# EAGLE design PCB-base (EAGLE 6.6.0)
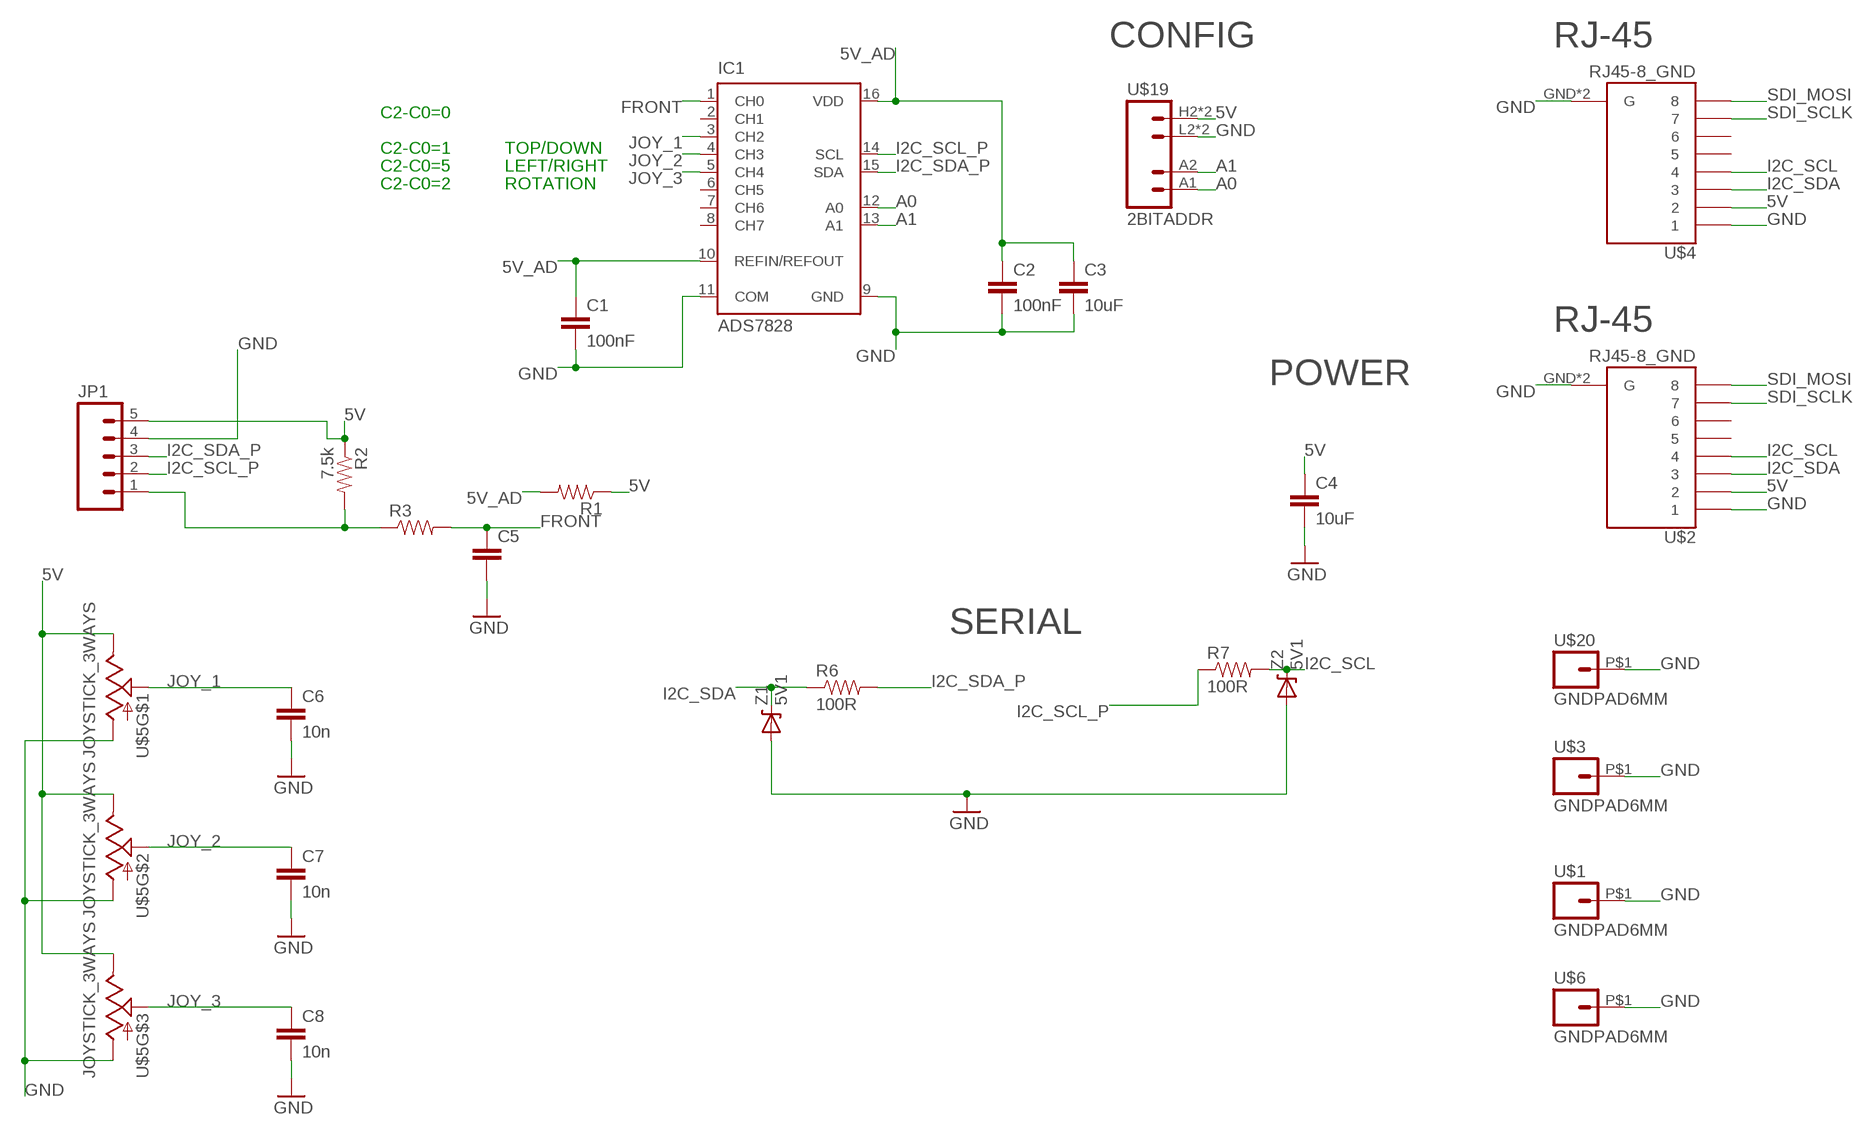
[diagram p0: schematic, sheet 1]

## Parts
C1  100nF  CAP0603-CAP  [0603-CAP]
C2  100nF  CAP0603-CAP  [0603-CAP]
C3  10uF  CAP0805  [0805]
C4  10uF  CAP0805  [0805]
C5  CAP0603-CAP  [0603-CAP]
C6  10n  CAP0603-CAP  [0603-CAP]
C7  10n  CAP0603-CAP  [0603-CAP]
C8  10n  CAP0603-CAP  [0603-CAP]
IC1  ADS7828  [TSSOP16-PW]
JP1  M05PTH  [1X05]
R1  RESISTOR0603-RES  [0603-RES]
R2  7.5k  RESISTOR0603-RES  [0603-RES]
R3  RESISTOR0603-RES  [0603-RES]
R6  100R  RESISTOR0603-RES  [0603-RES]
R7  100R  RESISTOR0603-RES  [0603-RES]
U$1  GNDPAD6MM  [3.2MMPAD6MM]
U$2  RJ45-8_GND  [RJ45-8_GND]
U$3  GNDPAD6MM  [3.2MMPAD6MM]
U$4  RJ45-8_GND  [RJ45-8_GND]
U$5  JOYSTICK_3WAYS  [JOYSTICK]
U$6  GNDPAD6MM  [3.2MMPAD6MM]
U$19  2BITADDR  [2BITADDR]
U$20  GNDPAD6MM  [3.2MMPAD6MM]
Z1  5V1  DIODE-ZENERSMB  [SMB-DIODE]
Z2  5V1  DIODE-ZENERSMB  [SMB-DIODE]

## Nets
5V [Power]: C4.1 JP1.5 R1.1 R2.1 U$2.2 U$4.2 U$5.LR_V(E) U$5.ROT_V(E) U$5.UD_V(E) U$19.H2(VCC) U$19.H3(VCC)
5V_AD [Power]: C1.1 C2.1 C3.1 IC1.10(REFIN/REFOUT) IC1.16(VDD) R1.2
A0: IC1.12(A0) U$19.A1
A1: IC1.13(A1) U$19.A2
FRONT: C5.1 IC1.1(CH0) R3.2
GND [Power]: C1.2 C2.2 C3.2 C4.2 C5.2 C6.2 C7.2 C8.2 IC1.9(GND) IC1.11(COM) JP1.4 U$1.P$1 U$2.1 U$2.GND1(G) U$2.GND(G) U$3.P$1 U$4.1 U$4.GND1(G) U$4.GND(G) U$5.LR_COM(A) U$5.ROT_COM(A) U$5.UD_COM(A) U$6.P$1 U$19.L2(GND) U$19.L3(GND) U$20.P$1 Z1.A Z2.A
I2C_SCL: R7.2 U$2.4 U$4.4 Z2.C
I2C_SCL_P: IC1.14(SCL) JP1.2 R7.1
I2C_SDA: R6.1 U$2.3 U$4.3 Z1.C
I2C_SDA_P: IC1.15(SDA) JP1.3 R6.2
JOY_1: C6.1 IC1.3(CH2) U$5.LR_C(S)
JOY_2: C7.1 IC1.4(CH3) U$5.UD_C(S)
JOY_3: C8.1 IC1.5(CH4) U$5.ROT_C(S)
N$234: JP1.1 R2.2 R3.1
SDI_MOSI: U$2.8 U$4.8
SDI_SCLK: U$2.7 U$4.7
Unconnected: IC1.2(CH1) IC1.6(CH5) IC1.7(CH6) IC1.8(CH7) U$2.5 U$2.6 U$4.5 U$4.6

## Notes on the sheet
- CONFIG | RJ-45
- C2-C0=0
- C2-C0=1 | TOP/DOWN
- C2-C0=5 | LEFT/RIGHT
- C2-C0=2 | ROTATION
- RJ-45
- POWER
- SERIAL

## Library data of the parts
C1-C8 = SparkFun:CAP: Capacitor Standard 0603 ceramic capacitor, and 0.1" leaded capacitor.
IC1 = burr-brown:ADS7828: 12-Bit, 8-Channel Sampling ANALOG-TO-DIGITAL CONVERTER with I2C? Interface Source: www.ti.com .. ADS7828.pdf; MF: TEXAS INSTRUMENTS; MPN: ADS7828E/250; OC_FARNELL: 1470338; OC_NEWARK: 74C7158
JP1 = SparkFun:M05: Header 5 Standard 5-pin 0.1" header. Use with straight break away headers (SKU : PRT-00116), right angle break away headers (PRT-00553), swiss pins (PRT-00743), machine pins (PRT-00117), and female headers (PRT-00115). Molex polarized connector foot print use with SKU : PRT-08230 with associated crimp pins and housings.
R1-R3 R6 R7 = SparkFun:RESISTOR: Resistor Basic schematic elements and footprints for 0603, 1206, and PTH resistors.
U$1 U$3 U$6 U$20 = SKAARHOJ:GNDPAD
U$2 U$4 = SKAARHOJ:RJ45-8_GND
U$5 = SKAARHOJ:JOYSTICK_3WAYS
U$19 = SKAARHOJ:2BITADDR
Z1 Z2 = SparkFun:DIODE-ZENER: Zener Diode Production Part - 8199 3.4V Zener Voltage

## Net classes
0 default: width 0.203 mm, drill 0.406 mm, clearance 0.203 mm
1 Power: width 0.406 mm, drill 0.61 mm, clearance 0.203 mm

## Board
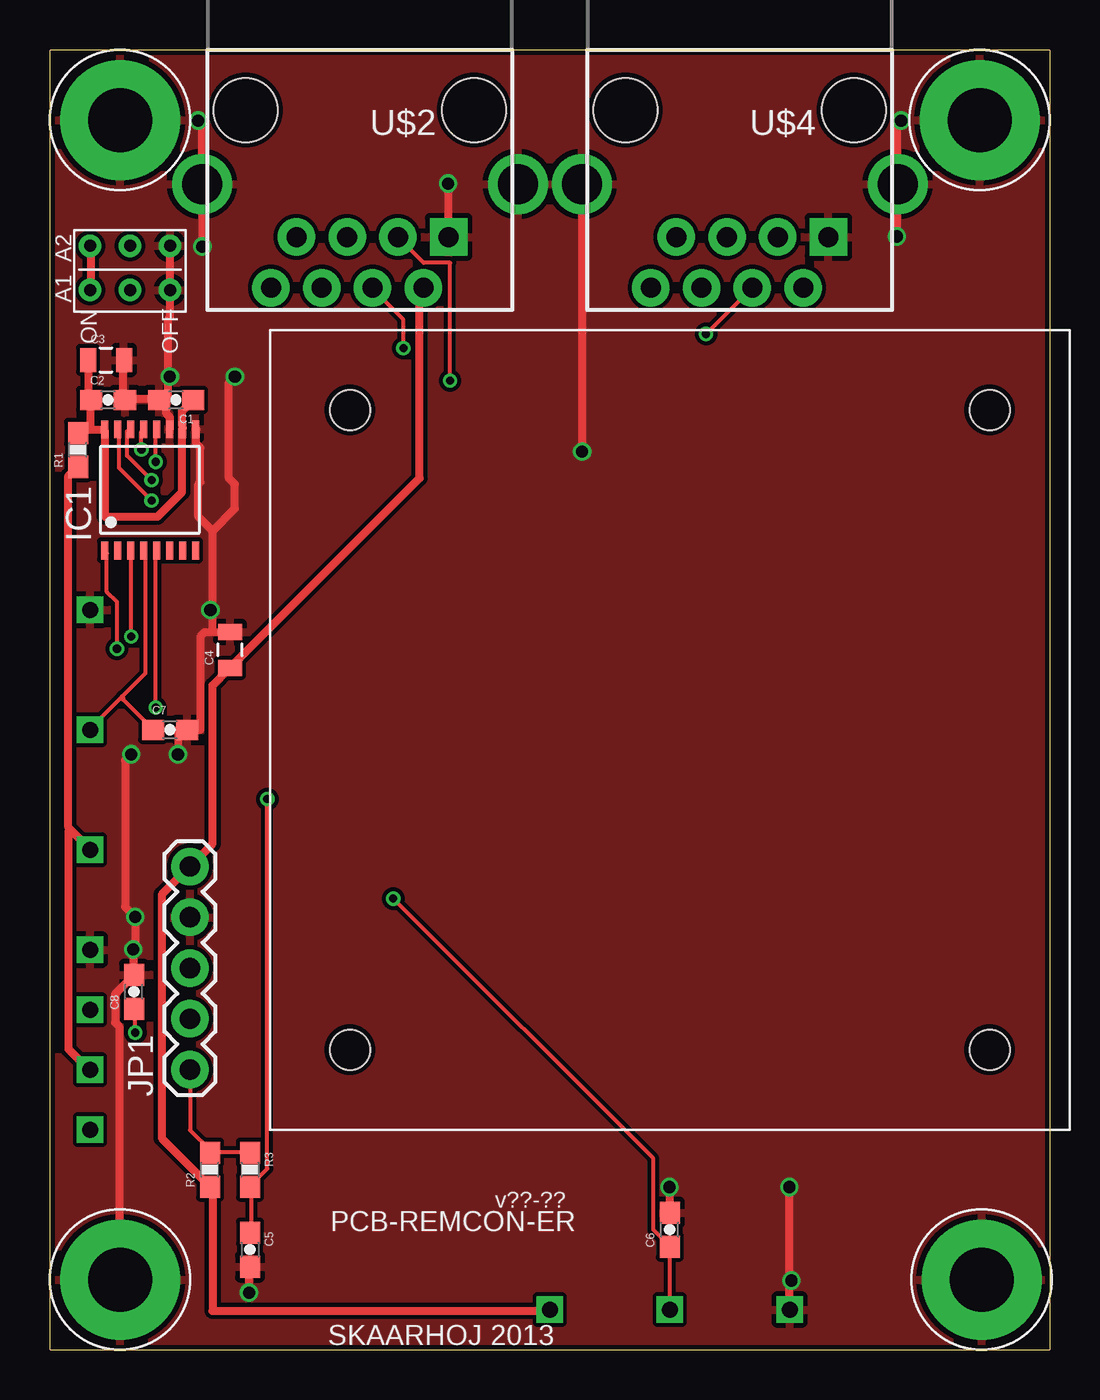
[diagram p1: board, top side]
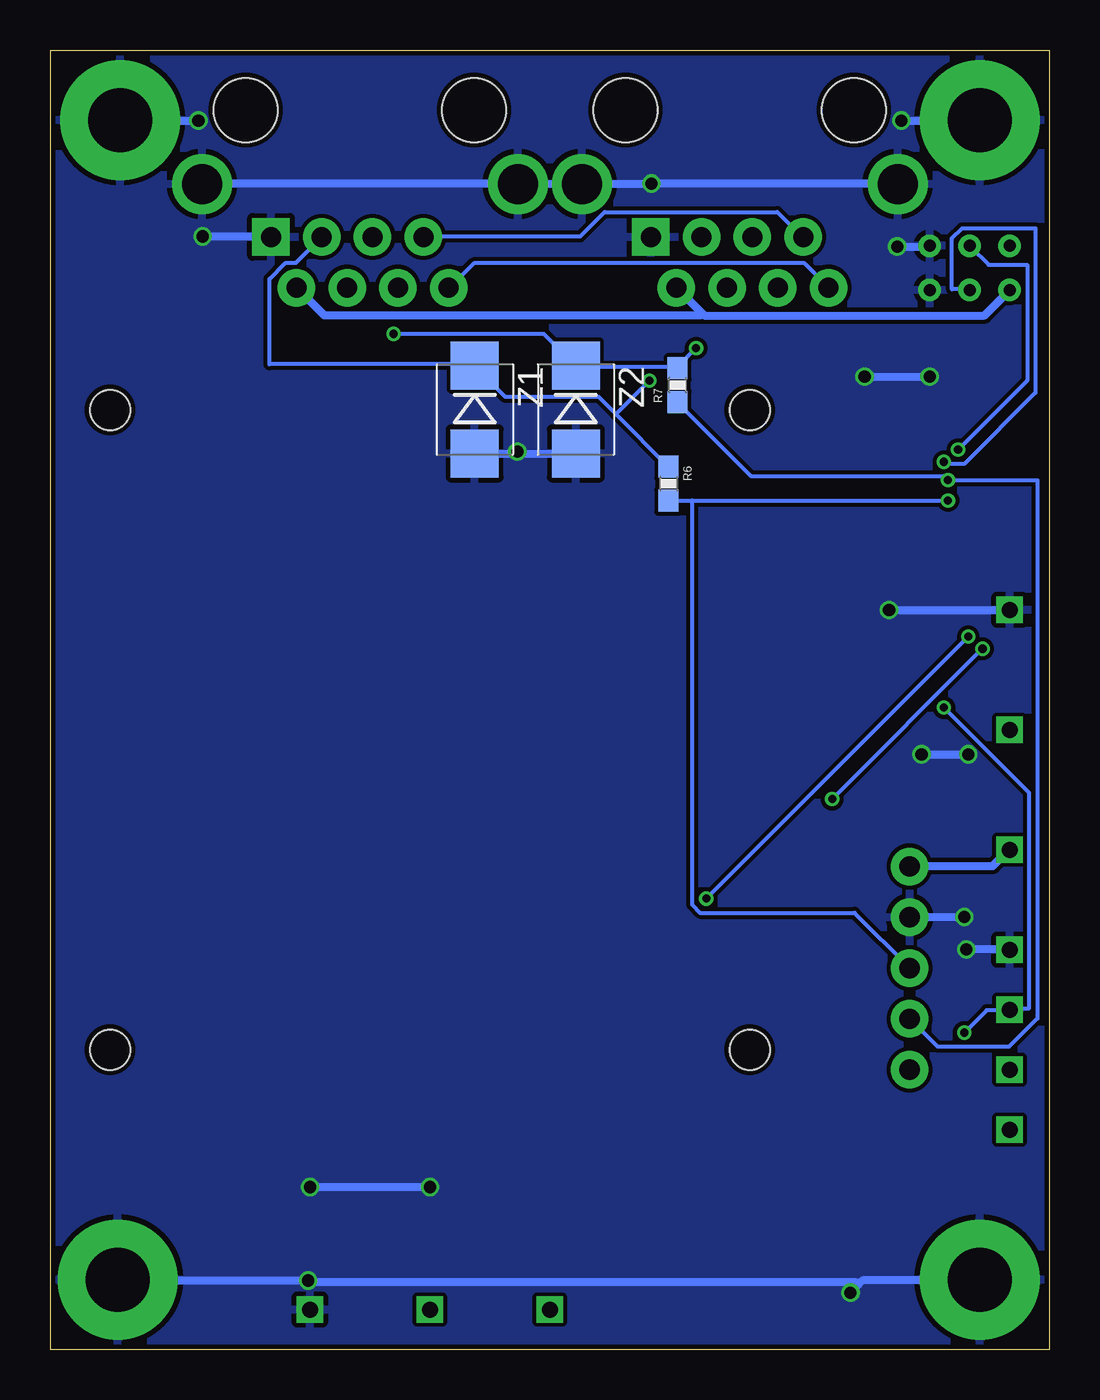
[diagram p2: board, bottom side, seen from below]

Size 50 x 65 mm. Coordinates in mm from the lower left corner, seen from the top.
Outline: 0,0 50,0 50,65 0,65 0,0
Copper layers (1*16): Top 0.035mm / dielectric 1.5mm / Bottom 0.035mm
Design rules "Fusion_eagle_rule_v1.1": minimum track width 6mil, minimum drill 12mil, track to track 6mil, track to pad 6mil, pad to pad 6mil, via to via 6mil, smd to smd 0mil, copper to edge 10mil, drill to drill 10mil, minimum pad ring 10mil, minimum via ring 6mil, stop-mask expansion 2mil, vias tented up to drill 100mil, thermal gap 10mil

### Footprints (pad centres in the part's own frame; a part is rotated, then mirrored left to right if it is on the bottom)
0603-CAP = smd 1.1 x 1: 1 -0.85,0; 2 0.85,0
0805 = smd 0.8 x 1.2: 1 -0.9,0; 2 0.9,0
TSSOP16-PW = smd 0.35 x 0.9: 1 -2.275,-3.025; 2 -1.625,-3.025; 3 -0.975,-3.025; 4 -0.325,-3.025; 5 0.325,-3.025; 6 0.975,-3.025; 7 1.625,-3.025; 8 2.275,-3.025; 9 2.275,3.025; 10 1.625,3.025; 11 0.975,3.025; 12 0.325,3.025; 13 -0.325,3.025; 14 -0.975,3.025; 15 -1.625,3.025; 16 -2.275,3.025
1X05 = drill 1.016 pad 1.88: 1 0,0; 2 2.54,0; 3 5.08,0; 4 7.62,0; 5 10.16,0
0603-RES = smd 1.1 x 1: 1 -0.85,0; 2 0.85,0
3.2MMPAD6MM = drill 3.2 pad 6: P$1 0,0
RJ45-8_GND = drill 1 pad 1.88 square: 1 -4.445,6.35 | drill 1 pad 1.88: 2 -3.175,8.89; 3 -1.905,6.35; 4 -0.635,8.89; 5 0.635,6.35; 6 1.905,8.89; 7 3.175,6.35; 8 4.445,8.89 | drill 2: GND -7.9,3.7; GND1 7.9,3.7 | hole 3.2: -5.715,0; 5.715,0
JOYSTICK = drill 0.8 square: LR_C 0,29; LR_COM -6,29; LR_V 6,29; PUSH 29,20; ROT_C 29,14; ROT_COM 29,11; ROT_V 29,17; UD_C 29,0; UD_COM 29,-6; UD_V 29,6 | hole 2: -16,16; 16,16; 16,-16; -16,-16
2BITADDR = drill 0.6: A1 0,0; A2 2.2,0; H2 0,2; H3 2.2,2; L2 0,-2; L3 2.2,-2
SMB-DIODE = smd 2.4 x 2.4: A 2.2,0; C -2.2,0

### Placement (x,y rotation side)
C1  6.3,47.5 180 top
C2  2.9,47.5 0 top
C3  2.8,49.5 0 top
C4  9,35 90 top
C5  10,5 270 top
C6  31,6 90 top
C7  6,31 0 top
C8  4.2,17.9 90 top
IC1  5,43 0 top
JP1  7,14 90 top
R1  1.4,45 90 top
R2  8,9 90 top
R3  10,9 270 top
R6  19.07,43.3 270 bottom
R7  18.61,48.23 90 bottom
U$1  3.5,61.5 0 top
U$2  15.5,62 180 top
U$3  46.6,3.5 0 top
U$4  34.5,62 180 top
U$5  31,31 180 top
U$6  46.5,61.5 0 top
U$19  4,53 90 top
U$20  3.5,3.5 0 top
Z1  28.75,47.02 270 bottom
Z2  23.7,47.02 270 bottom

### Tracks (layer width: path | path; a pad name or v marks a point on that pad's centre or on a via)
5V
  Top 0.406: U$19.H2 2.03,53.03 2.03,55.17 U$19.H3 | 1.02,26.01 1.93,25.09 U$5.UD_V | 1.02,26.01 0.91,26.11 0.91,43.69 1.32,44.09 R1.1 | U$5.ROT_V 1.93,14.02 0.91,15.04 0.91,25.91 1.02,26.01 | U$5.LR_V 24.99,1.93 8.13,1.93 8.13,8.03 R2.1 7.92,8.23 5.59,10.57 5.59,22.76 6.91,24.08 JP1.5 7.11,24.28 8.13,25.3 8.13,33.22 8.94,34.04 C4.1 9.14,34.24 18.49,43.59 18.49,52.93 18.59,53.03 U$2.2
  Bottom 0.406: 17.37,51.82 18.59,53.03 U$2.2 | 17.37,51.82 17.27,51.71 3.25,51.71 2.03,52.93 U$19.H2 | U$4.2 37.59,53.03 36.27,51.71 17.48,51.71 17.37,51.82 | U$5.UD_V 2.03,24.99 2.85,24.18 6.91,24.18 JP1.5
5V_AD
  Top 0.406: 2.03,46.02 1.42,46.02 1.42,45.92 R1.2 | 2.03,46.02 2.64,46.02 IC1.16 2.74,45.92 2.74,41.66 5.38,41.66 6.6,42.88 6.6,46.02 IC1.10 6.6,46.23 6.6,46.94 7.11,47.45 C1.1 | 2.03,46.02 2.03,47.45 C2.1 1.93,47.65 1.93,49.48 C3.1
A0  (via drill 0.41)
  Top 0.203: v5.28,44.4 5.28,46.02 IC1.12
  Bottom 0.203: v5.28,44.4 5.18,44.3 4.27,44.3 0.71,47.85 0.71,56.08 4.37,56.08 4.88,55.58 4.88,53.03 4.06,53.03 U$19.A1
A1  (via drill 0.41)
  Top 0.203: v4.57,45.01 4.57,45.92 IC1.13
  Bottom 0.203: v4.57,45.01 1.12,48.46 1.12,54.25 3.05,54.25 3.96,55.17 U$19.A2
FRONT  (via drill 0.41)
  Top 0.203: v3.35,35.05 3.35,37.39 2.85,37.9 2.85,39.83 2.74,39.93 IC1.1 | v10.87,27.53 10.87,9.04 10.06,8.23 R3.2 10.06,8.13 10.06,5.89 C5.1
  Bottom 0.203: v10.87,27.53 v3.35,35.05
GND  (via drill 0.61)
  Top 0.406: v42.37,55.68 42.37,58.22 U$4.GND 42.37,58.42 42.37,61.27 v42.57,61.47 | v19.91,58.32 19.91,55.68 U$2.1 | v26.62,44.91 26.62,58.22 U$4.GND1 | IC1.11 5.99,46.13 5.99,46.63 5.79,46.84 5.79,47.55 5.49,47.55 C1.2 | C1.2 5.28,47.55 3.76,47.55 C2.2 3.66,47.65 3.66,49.48 C3.2 | U$19.L3 5.99,55.17 5.99,53.03 U$19.L2 5.99,52.83 5.99,51.61 5.89,51.51 5.89,48.67 | v7.42,61.47 7.62,61.27 7.62,58.32 U$2.GND1 7.62,58.12 v7.62,55.17 | 5.89,48.67 5.89,47.65 C1.2 | v30.99,8.13 30.99,6.91 C6.2 | 36.98,3.45 36.98,2.03 U$5.LR_COM | 36.98,3.45 v36.98,8.13 | v37.08,3.45 36.98,3.45 | v9.96,2.85 9.96,4.06 C5.2 | 8.13,40.95 7.42,41.66 7.42,43.28 7.52,43.38 7.52,45.11 7.32,45.31 7.32,46.02 IC1.9 | 8.13,35.97 8.13,36.98 | 8.13,36.98 8.13,40.95 | 8.13,35.97 8.23,35.87 8.94,35.87 C4.2 | 8.13,35.97 8.03,35.87 7.72,35.87 7.52,35.66 7.52,30.99 6.91,30.99 C7.2 6.71,30.99 6.4,30.99 v6.4,29.77 | v8.03,36.98 8.13,36.98 | v4.06,29.77 3.76,29.46 3.76,22.15 v4.27,21.64 4.27,20.12 v4.17,20.02 4.17,18.8 C8.2 3.96,18.8 3.96,18.49 3.25,17.78 3.25,16.36 3.45,16.15 3.45,3.56 U$20.P$1 | v9.25,48.67 8.94,48.36 8.94,43.59 9.25,43.28 9.25,42.06 8.13,40.95 | v5.99,48.67 5.89,48.67
  Bottom 0.406: v42.37,55.68 39.01,55.68 U$4.1 | v42.57,61.47 46.43,61.47 U$6.P$1 | 26.62,44.81 28.75,44.81 Z1.A | 26.62,44.81 23.77,44.81 Z2.A | v26.62,44.91 26.62,44.81 | v7.42,61.47 3.56,61.47 U$1.P$1 | v7.62,55.17 6.1,55.17 U$19.L3 | U$2.GND1 7.62,58.32 v19.91,58.32 23.37,58.32 U$2.GND 23.57,58.32 26.52,58.32 U$4.GND1 26.72,58.32 42.37,58.32 U$4.GND | v36.98,8.13 v30.99,8.13 | U$3.P$1 46.53,3.45 v37.08,3.45 36.98,3.35 9.65,3.35 9.55,3.25 | 9.55,3.25 9.35,3.45 3.56,3.45 U$20.P$1 | 9.55,3.25 v9.96,2.85 | v4.17,20.02 2.03,20.02 U$5.ROT_COM | v4.27,21.64 6.91,21.64 JP1.4 | v8.03,36.98 2.03,36.98 U$5.UD_COM | v6.4,29.77 v4.06,29.77 | v9.25,48.67 v5.99,48.67
  pour Top: 0,0 50,0 50,65 0,65
  pour Bottom: 0,0 50,0 50,65 0,65
I2C_SCL  (via drill 0.41)
  Top 0.203: v17.68,50.09 17.68,51.51 16.15,53.03 U$2.4 | v32.82,50.8 35.05,53.03 U$4.4
  Bottom 0.203: v17.68,50.09 18.59,49.17 R7.2 18.69,49.17 23.67,49.17 Z2.C 23.77,49.28 25.3,50.8 v32.82,50.8
I2C_SCL_P  (via drill 0.41)
  Top 0.203: v5.08,43.48 3.86,44.7 3.86,45.92 3.96,46.02 IC1.14
  Bottom 0.203: R7.1 18.59,47.35 14.94,43.69 5.28,43.69 v5.08,43.48 0.61,43.48 0.61,16.56 2.03,15.14 5.59,15.14 6.91,16.46 JP1.2
I2C_SDA  (via drill 0.41)
  Top 0.203: v20.02,48.46 20.02,54.36 18.69,54.36 17.48,55.58 U$2.3
  Bottom 0.203: 21.69,46.79 22.55,47.65 27.23,47.65 28.75,49.17 Z1.C 28.85,49.28 39.01,49.28 39.01,53.54 38.2,54.36 37.69,54.36 36.47,55.58 U$4.3 | 21.69,46.79 19.1,44.2 R6.1 | 21.69,46.79 v20.02,48.46
I2C_SDA_P  (via drill 0.41)
  Top 0.203: v5.08,42.47 3.45,44.09 3.45,46.02 IC1.15
  Bottom 0.203: 17.88,42.47 19,42.47 R6.2 | 17.88,42.47 v5.08,42.47 | 17.88,42.47 17.88,22.25 17.48,21.84 9.75,21.84 7.01,19.1 JP1.3
JOY_1  (via drill 0.41)
  Top 0.203: v4.06,35.66 4.06,39.93 IC1.3 | v17.17,22.55 30.18,9.55 30.18,5.99 30.99,5.18 C6.1 30.99,5.08 30.99,2.03 U$5.LR_C
  Bottom 0.203: v17.17,22.55 v4.06,35.66
JOY_2
  Top 0.203: 3.61,32.66 2.03,31.09 U$5.UD_C | 3.61,32.66 4.78,33.83 4.78,39.93 IC1.4 | C7.1 5.08,31.09 3.66,32.51 3.66,32.61 3.61,32.66
JOY_3  (via drill 0.41)
  Top 0.203: v5.28,32.11 5.28,39.93 IC1.5 | v4.27,15.85 4.27,16.97 C8.1
  Bottom 0.203: v5.28,32.11 1.02,27.84 1.02,17.07 1.93,17.07 U$5.ROT_C 2.03,16.97 3.15,16.97 v4.27,15.85
N$234
  Top 0.203: R3.1 9.96,9.86 8.03,9.86 R2.2 8.03,9.96 7.01,10.97 7.01,13.92 JP1.1
SDI_MOSI
  Bottom 0.203: U$2.8 11.07,53.14 12.29,54.36 28.75,54.36 29.97,53.14 U$4.8
SDI_SCLK
  Bottom 0.203: U$2.7 12.39,55.68 13.61,56.9 22.25,56.9 23.47,55.68 31.29,55.68 U$4.7

### Text on the board
_tsilk: v??-?? | PCB-REMCON-ER | SKAARHOJ 2013